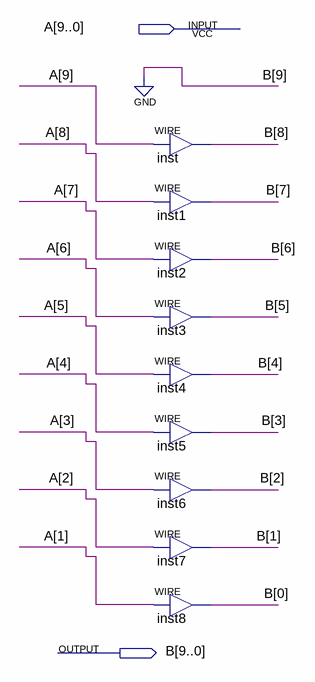
[diagram p0: schematic sheet]
// Quartus schematic shift_right1_10.bdf as structural Verilog: 9 symbols, 2 pins
module shift_right1_10 (
  input  [9:0] A,
  output [9:0] B
);

  assign B[8] = A[9];  // WIRE inst
  assign B[7] = A[8];  // WIRE inst1
  assign B[6] = A[7];  // WIRE inst2
  assign B[5] = A[6];  // WIRE inst3
  assign B[4] = A[5];  // WIRE inst4
  assign B[3] = A[4];  // WIRE inst5
  assign B[2] = A[3];  // WIRE inst6
  assign B[1] = A[2];  // WIRE inst7
  assign B[0] = A[1];  // WIRE inst8

  assign B[9] = 1'b0;
endmodule
